# EAGLE design Quadcopter_Schematic_Final (EAGLE 7.2.0)
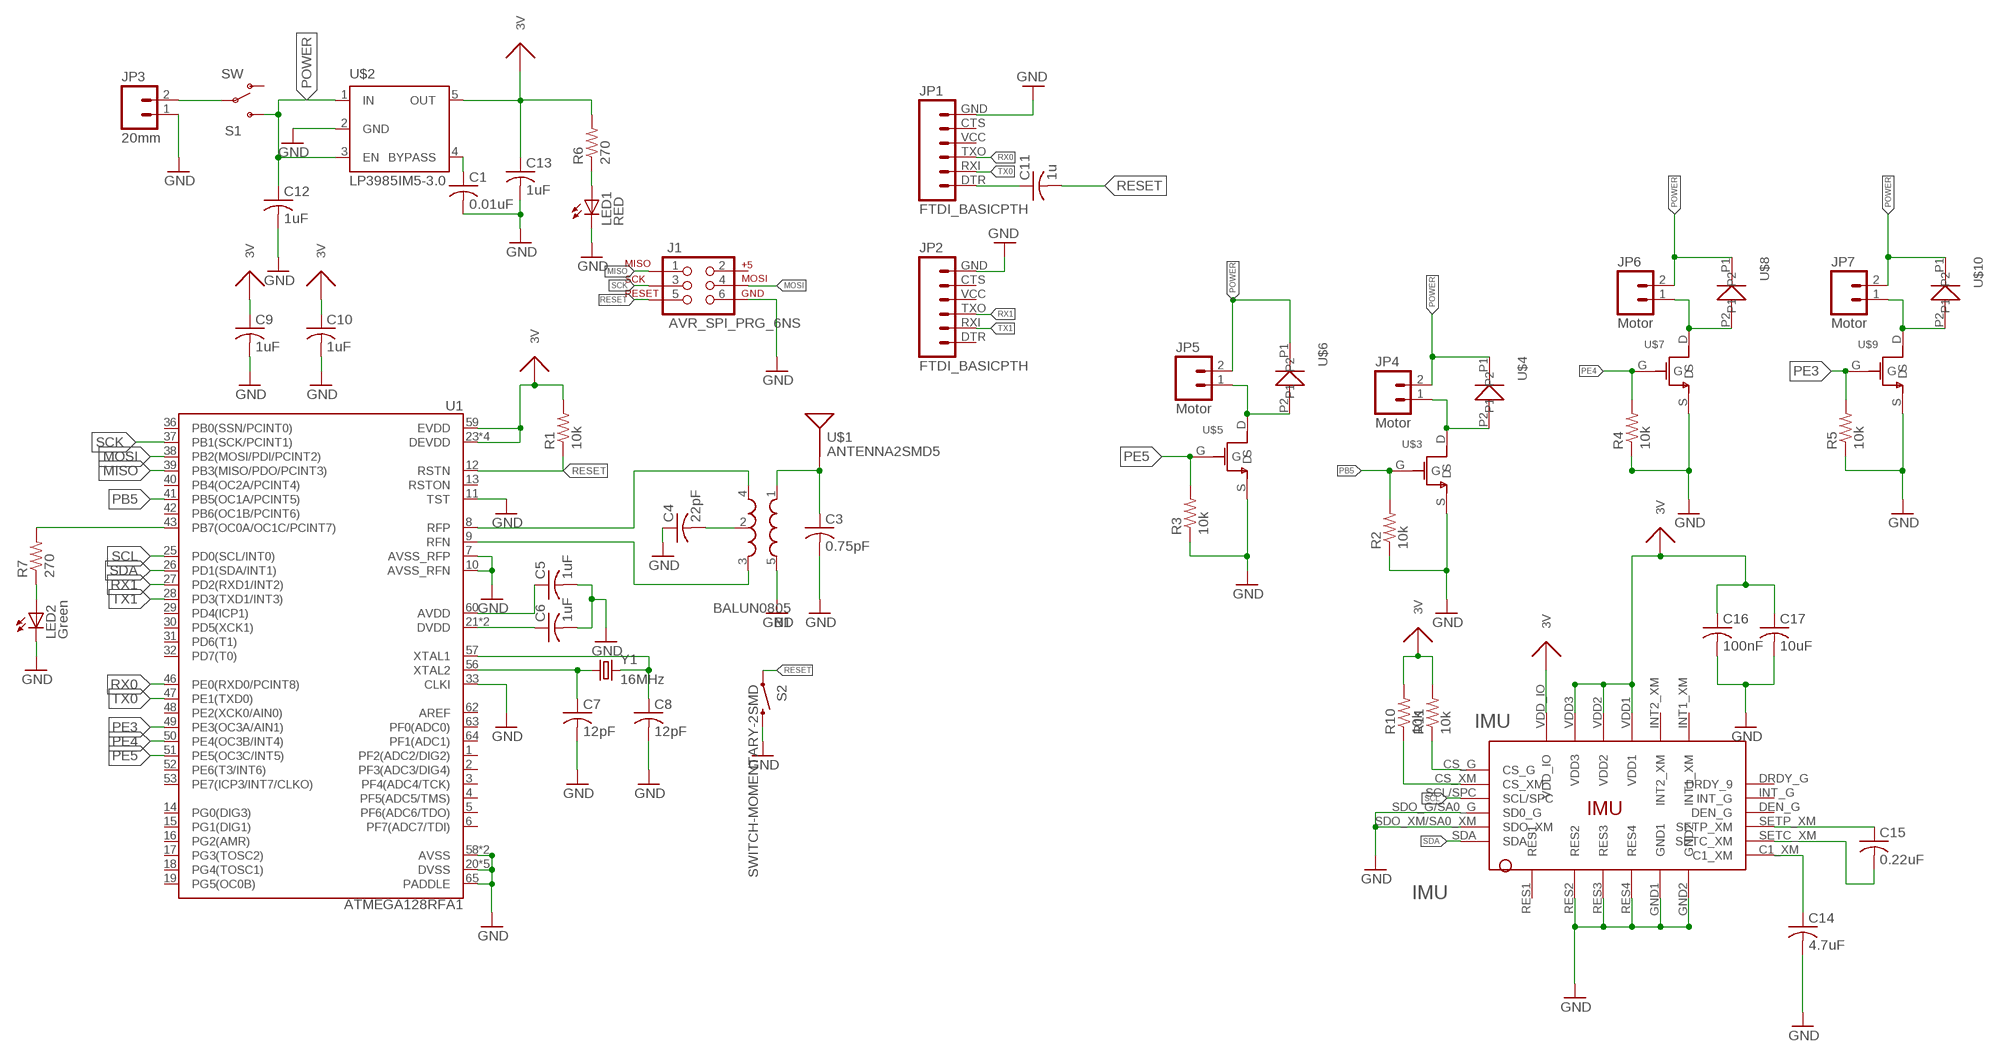
[diagram p0: schematic, sheet 1]

## Parts
B1  BALUN0805  [BALUN]
C1  0.01uF  C-USC0805  [C0805]
C3  0.75pF  C-USC0805  [C0805]
C4  22pF  C-USC0805  [C0805]
C5  1uF  C-USC0805  [C0805]
C6  1uF  C-USC0805  [C0805]
C7  12pF  C-USC0805  [C0805]
C8  12pF  C-USC0805  [C0805]
C9  1uF  C-USC0805  [C0805]
C10  1uF  C-USC0805  [C0805]
C11  1u  C-USC0805  [C0805]
C12  1uF  C-USC0805  [C0805]
C13  1uF  C-USC0805  [C0805]
C14  4.7uF  C-USC0805  [C0805]
C15  0.22uF  C-USC0805  [C0805]
C16  100nF  C-USC0805  [C0805]
C17  10uF  C-USC0805  [C0805]
IMU  IMU  LSM9DS0  [LSM9DS0]
J1  AVR_SPI_PRG_6NS  [2X3-NS]
JP1  FTDI_BASICPTH  [FTDI_BASIC]
JP2  FTDI_BASICPTH  [FTDI_BASIC]
JP3  20mm  M02PTH  [1X02]
JP4  Motor  M02PTH  [1X02]
JP5  Motor  M02PTH  [1X02]
JP6  Motor  M02PTH  [1X02]
JP7  Motor  M02PTH  [1X02]
LED1  RED  LEDCHIP-LED0805  [CHIP-LED0805]
LED2  Green  LEDCHIP-LED0805  [CHIP-LED0805]
R1  10k  R-US_R0805  [R0805]
R2  10k  R-US_R0805  [R0805]
R3  10k  R-US_R0805  [R0805]
R4  10k  R-US_R0805  [R0805]
R5  10k  R-US_R0805  [R0805]
R6  270  R-US_R0805  [R0805]
R7  270  R-US_R0805  [R0805]
R10  10k  R-US_R0805  [R0805]
R11  10k  R-US_R0805  [R0805]
S1  SW  SWITCH-SPDTPTH  [SWITCH-SPDT]
S2  SWITCH-MOMENTARY-2SMD  [TACTILE_SWITCH_SMD]
U1  ATMEGA128RFA1  [QFN-64]
U$1  ANTENNA2SMD5  [ANTENNA-CHIP5]
U$2  LP3985IM5-3.0  [SOT23-DBV]
U$3  NMOS  SI2302DS_MOSFET  [SI2302DS_MOSFET]
U$4  Diode  BAS16WS_DIODE  [BAS16WS_DIODE]
U$5  NMOS  SI2302DS_MOSFET  [SI2302DS_MOSFET]
U$6  Diode  BAS16WS_DIODE  [BAS16WS_DIODE]
U$7  NMOS  SI2302DS_MOSFET  [SI2302DS_MOSFET]
U$8  Diode  BAS16WS_DIODE  [BAS16WS_DIODE]
U$9  NMOS  SI2302DS_MOSFET  [SI2302DS_MOSFET]
U$10  Diode  BAS16WS_DIODE  [BAS16WS_DIODE]
Y1  16MHz  CRYSTAL5X3  [CRYSTAL-SMD-5X3]

## Nets
3V: C9.1 C10.1 C13.1 C16.1 C17.1 IMU.VDD1 IMU.VDD2 IMU.VDD3 IMU.VDD_IO R1.2 R6.2 R10.2 R11.2 U1.23(DEVDD) U1.34(DEVDD) U1.44(DEVDD) U1.54(DEVDD) U1.59(EVDD) U$2.5(OUT)
FTDI: C11.1 JP1.DTR
GND: B1.5(GND) C1.2 C3.2 C4.1 C5.2 C6.2 C7.2 C8.2 C9.2 C10.2 C12.2 C13.2 C14.2 C16.2 C17.2 IMU.GND1 IMU.GND2 IMU.RES2 IMU.RES3 IMU.RES4 IMU.SDO_G/SA0_G(SD0_G) IMU.SDO_XM/SA0_XM(SDO_XM) J1.6 JP1.GND JP2.GND JP3.1 LED1.C LED2.C R2.1 R3.1 R4.1 R5.1 S2.3 U1.7(AVSS_RFP) U1.10(AVSS_RFN) U1.11(TST) U1.20(DVSS) U1.24(DVSS) U1.33(CLKI) U1.35(DVSS) U1.45(DVSS) U1.55(DVSS) U1.58(AVSS) U1.61(AVSS) U1.65(PADDLE) U$2.2(GND) U$3.S U$5.S U$7.S U$9.S
MISO: J1.1 U1.39(PB3(MISO/PDO/PCINT3))
MOSI: J1.4 U1.38(PB2(MOSI/PDI/PCINT2))
N$1: B1.4(OUT1) U1.8(RFP)
N$2 [HIGHCURRENT]: JP5.1 U$5.D U$6.P2
N$3: JP3.2 S1.2(P)
N$4: C5.1 U1.60(AVDD)
N$5: C6.1 U1.21(DVDD) U1.22(DVDD)
N$6: B1.2(GND) C4.2
N$7: B1.3(OUT2) U1.9(RFN)
N$8: C8.1 U1.57(XTAL1) Y1.3
N$9 [RFSIG]: B1.1(IN) C3.1 U$1.FEED(SIGNAL)
N$10: LED1.A R6.1
N$11: LED2.A R7.1
N$12: C7.1 U1.56(XTAL2) Y1.1
N$14: C1.1 U$2.4(BYPASS)
N$15: IMU.CS_G R11.1
N$16: IMU.CS_XM R10.1
N$22 [HIGHCURRENT]: JP4.1 U$3.D U$4.P2
N$23: C14.1 IMU.C1_XM
N$24: C15.2 IMU.SETC_XM
N$25: C15.1 IMU.SETP_XM
N$33 [HIGHCURRENT]: JP6.1 U$7.D U$8.P2
N$38 [HIGHCURRENT]: JP7.1 U$9.D U$10.P2
PB5: R2.2 U1.41(PB5(OC1A/PCINT5)) U$3.G
PB7: R7.2 U1.43(PB7(OC0A/OC1C/PCINT7))
PE3: R5.2 U1.49(PE3(OC3A/AIN1)) U$9.G
PE4: R4.2 U1.50(PE4(OC3B/INT4)) U$7.G
PE5: R3.2 U1.51(PE5(OC3C/INT5)) U$5.G
POWER [HIGHCURRENT]: C12.1 JP4.2 JP5.2 JP6.2 JP7.2 S1.3(S) U$2.1(IN) U$2.3(EN) U$4.P1 U$6.P1 U$8.P1 U$10.P1
RESET: C11.2 J1.5 R1.1 S2.1 U1.12(RSTN)
RX0: JP1.TXO U1.46(PE0(RXD0/PCINT8))
RX1: JP2.TXO U1.27(PD2(RXD1/INT2))
SCK: J1.3 U1.37(PB1(SCK/PCINT1))
SCL: IMU.SCL/SPC U1.25(PD0(SCL/INT0))
SDA: IMU.SDA U1.26(PD1(SDA/INT1))
TX0: JP1.RXI U1.47(PE1(TXD0))
TX1: JP2.RXI U1.28(PD3(TXD1/INT3))
Unconnected: IMU.DEN_G IMU.DRDY_G(DRDY_9) IMU.INT1_XM IMU.INT2_XM IMU.INT_G IMU.RES1 J1.2 JP1.CTS JP1.VCC JP2.CTS JP2.DTR JP2.VCC S1.1(O) U1.1(PF2(ADC2/DIG2)) U1.2(PF3(ADC3/DIG4)) U1.3(PF4(ADC4/TCK)) U1.4(PF5(ADC5/TMS)) U1.5(PF6(ADC6/TDO)) U1.6(PF7(ADC7/TDI)) U1.13(RSTON) U1.14(PG0(DIG3)) U1.15(PG1(DIG1)) U1.16(PG2(AMR)) U1.17(PG3(TOSC2)) U1.18(PG4(TOSC1)) U1.19(PG5(OC0B)) U1.29(PD4(ICP1)) U1.30(PD5(XCK1)) U1.31(PD6(T1)) U1.32(PD7(T0)) U1.36(PB0(SSN/PCINT0)) U1.40(PB4(OC2A/PCINT4)) U1.42(PB6(OC1B/PCINT6)) U1.48(PE2(XCK0/AIN0)) U1.52(PE6(T3/INT6)) U1.53(PE7(ICP3/INT7/CLKO)) U1.62(AREF) U1.63(PF0(ADC0)) U1.64(PF1(ADC1))

## Library data of the parts
B1 = Lab5:BALUN: 0805 footprint balun- Ember 351/357
C1 C3-C17 = Lab5:C-US: CAPACITOR, American symbol
IMU = Andranik-Lab4:LSM9DS0; DIST: Digikey; DISTPN: LSM9DS0
J1 = Lab5:AVR_SPI_PRG_6: AVR ISP 6 Pin This is the reduced ISP connector for AVR programming. Common on Arduino. This footprint will take up less PCB space and can be used with a 10-pin to 6-pin adapter such as SKU: BOB-08508
JP1 JP2 = Lab5:FTDI_BASIC: FTDI Basic header with labels
JP3-JP7 = Lab5:M02: Header 2 Standard 2-pin 0.1" header. Use with straight break away headers (SKU : PRT-00116), right angle break away headers (PRT-00553), swiss pins (PRT-00743), machine pins (PRT-00117), and female headers (PRT-00115). Molex polarized connector foot print use with SKU : PRT-08233 with associated crimp pins and housings.
LED1 LED2 = Lab5:LED: LED OSRAM: - CHIPLED LG R971, LG N971, LY N971, LG Q971, LY Q971, LO R971, LY R971 LH N974, LH R974 LS Q976, LO Q976, LY Q976 LO Q996 - Hyper CHIPLED LW Q18S LB Q993, LB Q99A, LB R99A - SideLED LS A670, LO A670, LY A670, LG A670, LP A670 LB A673, LV A673, LT A673, LW A673 LH A674 LY A675 LS A676, LA A676, LO A676, LY A676, LW A676 LS A679, LY A679, LG A679 - Hyper Micro SIDELED® LS Y876, LA Y876, LO Y876, LY Y876 LT Y87S - SmartLED LW L88C, LW L88S LB L89C, LB L89S, LG L890 LS L89K, LO L89K, LY L89K LS L896, LA L896, LO L896, LY L896 - TOPLED LS T670, LO T670, LY T670, LG T670, LP T670 LSG T670, LSP T670, LSY T670, LOP T670, LYG T670 LG T671, LOG T671, LSG T671 LB T673, LV T673, LT T673, LW T673 LH T674 LS T676, LA T676, LO T676, LY T676, LB T676, LH T676, LSB T676, LW T676 LB T67C, LV T67C, LT T67C, LS T67K, LO T67K, LY T67K, LW E67C LS E67B, LA E67B, LO E67B, LY E67B, LB E67C, LV E67C, LT E67C LW T67C LS T679, LY T679, LG T679 LS T770, LO T770, LY T770, LG T770, LP T770 LB T773, LV T773, LT T773, LW T773 LH T774 LS E675, LA E675, LY E675, LS T675 LS T776, LA T776, LO T776, LY T776, LB T776 LHGB T686 LT T68C, LB T68C - Hyper Mini TOPLED® LB M676 - Mini TOPLED Santana® LG M470 LS M47K, LO M47K, LY M47K Source: http://www.osram.convergy.de LUXEON: - LUMILED® LXK2-PW12-R00, LXK2-PW12-S00, LXK2-PW14-U00, LXK2-PW14-V00 LXK2-PM12-R00, LXK2-PM12-S00, LXK2-PM14-U00 LXK2-PE12-Q00, LXK2-PE12-R00, LXK2-PE12-S00, LXK2-PE14-T00, LXK2-PE14-U00 LXK2-PB12-K00, LXK2-PB12-L00, LXK2-PB12-M00, LXK2-PB14-N00, LXK2-PB14-P00, LXK2-PB14-Q00 LXK2-PR12-L00, LXK2-PR12-M00, LXK2-PR14-Q00, LXK2-PR14-R00 LXK2-PD12-Q00, LXK2-PD12-R00, LXK2-PD12-S00 LXK2-PH12-R00, LXK2-PH12-S00 LXK2-PL12-P00, LXK2-PL12-Q00, LXK2-PL12-R00 Source: www.luxeon.com KINGBRIGHT: KA-3528ASYC Source: www.kingbright.com
R1-R7 R10 R11 = Lab5:R-US_: RESISTOR, American symbol
S1 = Lab5:SWITCH-SPDT: SPDT Switch Simple slide switch, Spark Fun Electronics SKU : COM-00102 DPDT SMT slide switch, AYZ0202, SWCH-08179; PROD_ID: SWCH-08261
S2 = Lab5:SWITCH-MOMENTARY-2: Various NO switches- pushbuttons, reed, etc
U1 = Lab5:ATMEGA128RFA1: ATmega128RFA1 8-bit AVR Microcontroller with Low Power 2.4GHz Transceiver for ZigBee and IEEE 802.15.4
U$1 = Lab5:ANTENNA2: Chip antenna Single endded antenna. Common with smaller chip antennas. CHIP4 package is the GPS Chip Antenna SKU: GPS-08418. CHIP5 package is 2.4GHz chip antenna SKU: WRL-00144.
U$2 = Lab5:LP3985IM5-3.0
U$3 U$5 U$7 U$9 = Andranik-Lab4:SI2302DS_MOSFET; DIST: Digikey; DISTPN: Si2302CDS
U$4 U$6 U$8 U$10 = Andranik-Lab4:BAS16WS_DIODE; DIST: VISHAY; DISTPT: BAS16WS
Y1 = Lab5:CRYSTAL: Various standard crystals. Proven footprints. Spark Fun Electronics SKU : COM-00534

## Net classes
0 default: clearance 0.205 mm
1 RFSIG: width 0.457 mm
2 HIGHCURRENT: width 0.457 mm

## Board
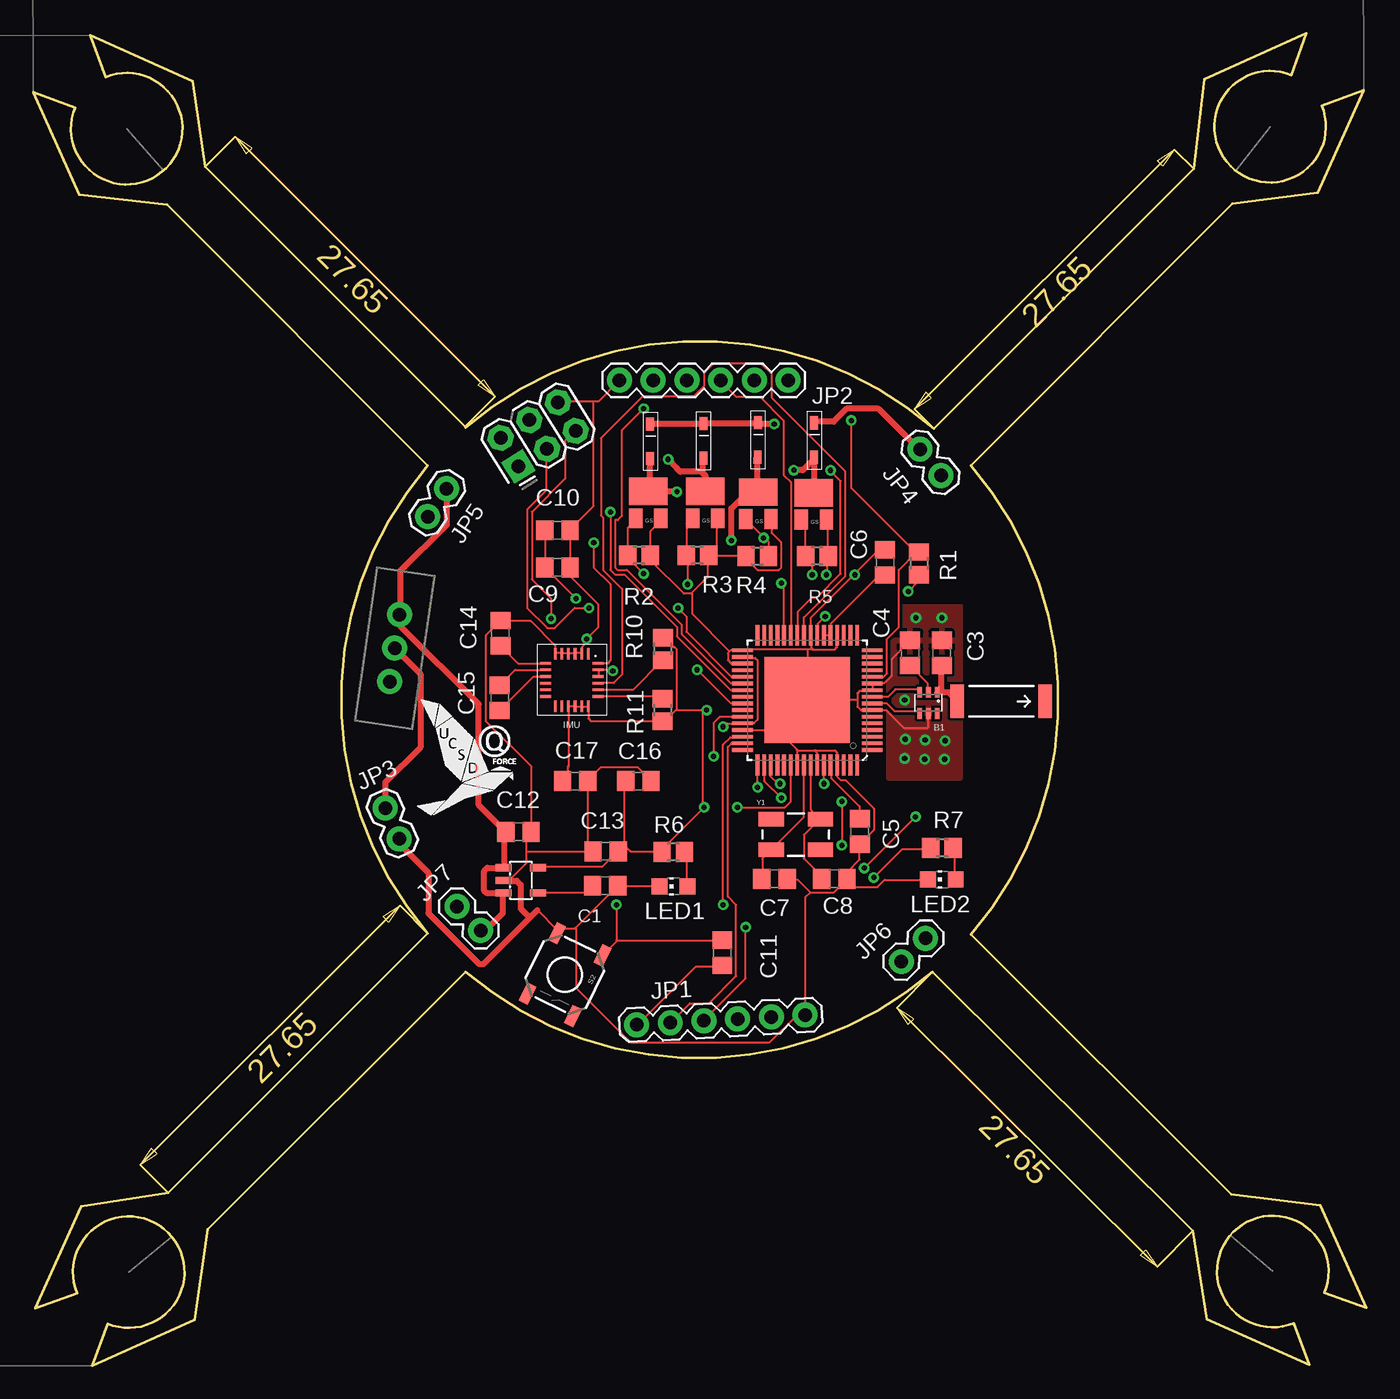
[diagram p1: board, top side]
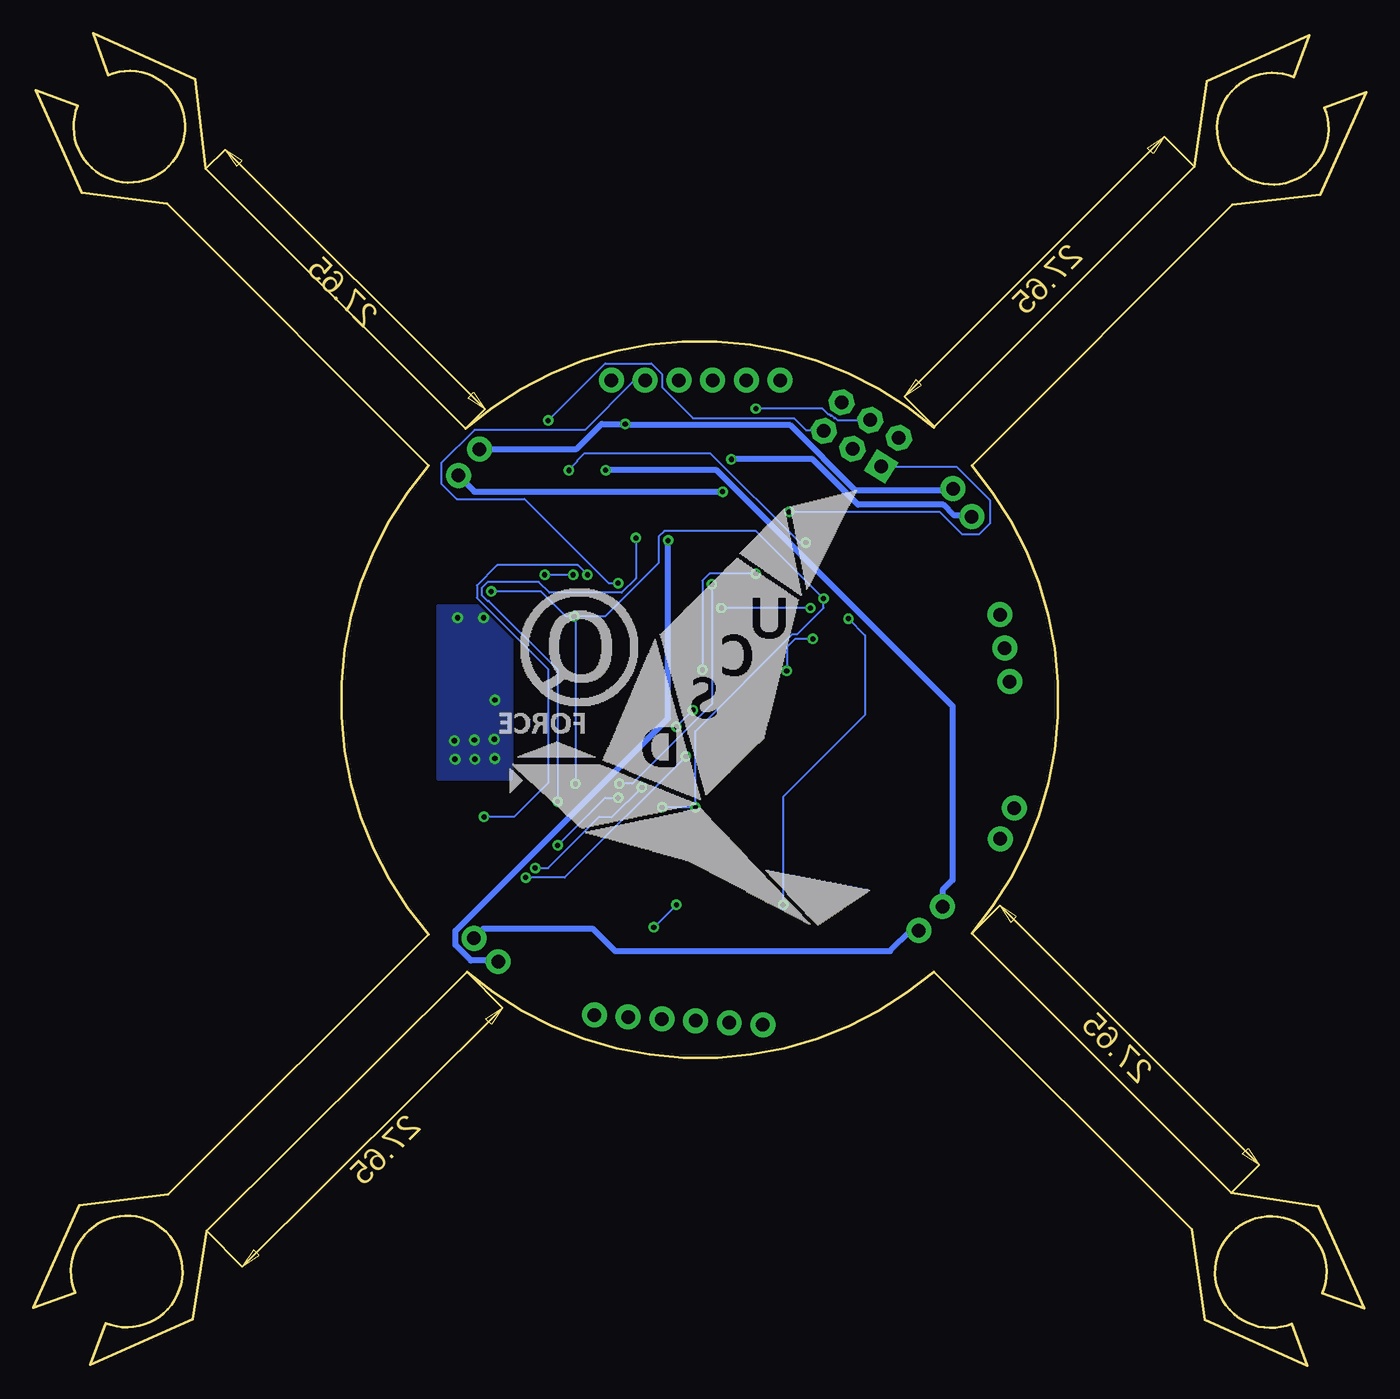
[diagram p2: board, bottom side, seen from below]

Size 100.35 x 100.3 mm. Coordinates in mm from the lower left corner, seen from the top.
Outline: 32.5,70.7 12.95,90.25 12,96.7 4.3,100.15 5.45,97 arc-314 3.15,94.7 0,95.85 3.45,88.15 10.1,87.4 29.7,67.75 arc81 29.7,32.55 10.15,13 3.6,12 0.15,4.3 3.3,5.45 arc-314 5.6,3.15 4.45,0 12.15,3.45 13.15,10.25 32.55,29.65 arc81 67.7,29.65 87.3,10.15 88.35,3.5 96.05,0.05 94.9,3.2 arc-314 97.2,5.5 100.35,4.35 96.9,12.05 90.2,12.9 70.6,32.45 arc82 70.6,67.75 90.25,87.45 96.7,88.3 100.15,96 97,94.85 arc-314 94.7,97.15 95.85,100.3 88.15,96.85 87.35,90.1 67.8,70.55 arc82 32.55,70.6
Copper layers (1*16): Top 0.035559375mm / dielectric 1.501140625mm / Bottom 0.035559375mm
Design rules "4pcb-33board": minimum track width 6mil, minimum drill 15mil, track to track 6mil, track to pad 6mil, pad to pad 6mil, via to via 6mil, smd to smd 6mil, copper to edge 10mil, drill to drill 10mil, minimum pad ring 10mil, minimum via ring 8mil, stop-mask expansion 4mil, vias tented up to drill 0mil, thermal gap 10mil
tRestrict: area 70.3,42 to 75.4,62.5; area 38,53.2 to 39,54.1; area 42,53.2 to 43.1,54.2; area 42.1,49.1 to 43,49.9; area 38,49.2 to 38.9,50; area 39.2,50.4 to 41.8,52.8
bRestrict: area 70.2,41.9 to 75.4,62.5; area 39.2,50.4 to 41.8,52.9; area 38,49.1 to 38.9,50; area 42.1,49.1 to 43,50; area 38,53.2 to 39,54.1; area 42.1,53.1 to 43.1,54.2

### Footprints (pad centres in the part's own frame; a part is rotated, then mirrored left to right if it is on the bottom)
BALUN = smd 0.35 x 0.8: 1 -0.65,-0.8; 2 0,-0.8; 3 0.65,-0.8; 4 0.65,0.8; 5 0,0.8; 6 -0.65,0.8
C0805 = smd 1.3 x 1.5: 1 -0.95,0; 2 0.95,0
LSM9DS0 = smd 0.85 x 0.2: C1_XM 1.975,-1.25; CS_G -1.975,1.25; CS_XM -1.975,0.75; DEN_G 1.975,0.25; DRDY_G 1.975,1.25; INT_G 1.975,0.75; SCL/SPC -1.975,0.25; SDA -1.975,-1.25; SDO_G/SA0_G -1.975,-0.25; SDO_XM/SA0_XM -1.975,-0.75; SETC_XM 1.975,-0.75; SETP_XM 1.975,-0.25 | smd 0.2 x 0.85: GND1 0.75,-1.975; GND2 1.25,-1.975; INT1_XM 1.25,1.975; INT2_XM 0.75,1.975; RES1 -1.25,-1.975; RES2 -0.75,-1.975; RES3 -0.25,-1.975; RES4 0.25,-1.975; VDD1 0.25,1.975; VDD2 -0.25,1.975; VDD3 -0.75,1.975; VDD_IO -1.25,1.975
2X3-NS = drill 1.016 pad 1.88 square: 1 -2.54,-1.27 | drill 1.016 pad 1.88 octagon: 2 -2.54,1.27; 3 0,-1.27; 4 0,1.27; 5 2.54,-1.27; 6 2.54,1.27
FTDI_BASIC = drill 1.016 pad 1.88: CTS 10.16,0; DTR 0,0; GND 12.7,0; RXI 2.54,0; TXO 5.08,0; VCC 7.62,0
1X02 = drill 1.016 pad 1.88: 1 0,0; 2 2.54,0
CHIP-LED0805 = smd 1.2 x 1.2: A 0,-1.05; C 0,1.05
R0805 = smd 1.3 x 1.5: 1 -0.85,0; 2 0.85,0
SWITCH-SPDT = drill 1.016 pad 1.88: 1 0,2.54; 2 0,0; 3 0,-2.54
TACTILE_SWITCH_SMD = smd 1.524 x 0.762: 1 -2.54,1.905; 2 2.54,1.905; 3 -2.54,-1.905; 4 2.54,-1.905
QFN-64 = smd 1.562 x 0.28: 1 -4.881,3.75; 2 -4.881,3.25; 3 -4.881,2.75; 4 -4.881,2.25; 5 -4.881,1.75; 6 -4.881,1.25; 7 -4.881,0.75; 8 -4.881,0.25; 9 -4.881,-0.25; 10 -4.881,-0.75; 11 -4.881,-1.25; 12 -4.881,-1.75; 13 -4.881,-2.25; 14 -4.881,-2.75; 15 -4.881,-3.25; 16 -4.881,-3.75; 33 4.881,-3.75; 34 4.881,-3.25; 35 4.881,-2.75; 36 4.881,-2.25; 37 4.881,-1.75; 38 4.881,-1.25; 39 4.881,-0.75; 40 4.881,-0.25; 41 4.881,0.25; 42 4.881,0.75; 43 4.881,1.25; 44 4.881,1.75; 45 4.881,2.25; 46 4.881,2.75; 47 4.881,3.25; 48 4.881,3.75 | smd 0.28 x 1.562: 17 -3.75,-4.881; 18 -3.25,-4.881; 19 -2.75,-4.881; 20 -2.25,-4.881; 21 -1.75,-4.881; 22 -1.25,-4.881; 23 -0.75,-4.881; 24 -0.25,-4.881; 25 0.25,-4.881; 26 0.75,-4.881; 27 1.25,-4.881; 28 1.75,-4.881; 29 2.25,-4.881; 30 2.75,-4.881; 31 3.25,-4.881; 32 3.75,-4.881; 49 3.75,4.881; 50 3.25,4.881; 51 2.75,4.881; 52 2.25,4.881; 53 1.75,4.881; 54 1.25,4.881; 55 0.75,4.881; 56 0.25,4.881; 57 -0.25,4.881; 58 -0.75,4.881; 59 -1.25,4.881; 60 -1.75,4.881; 61 -2.25,4.881; 62 -2.75,4.881; 63 -3.25,4.881; 64 -3.75,4.881 | smd 6.452 x 6.452: 65 0,0
ANTENNA-CHIP5 = smd 1.016 x 2.54: FEED -3.302,0; NC 3.302,0
SOT23-DBV = smd 0.55 x 1.2: 1 -0.95,-1.3; 2 0,-1.3; 3 0.95,-1.3; 4 0.95,1.3; 5 -0.95,1.3
SI2302DS_MOSFET = smd 2.9 x 2.05: D 0,1.85 | smd 1 x 1.5: G -0.95,-0.175; S 0.95,-0.175
BAS16WS_DIODE = smd 1 x 0.6: P1 -1.3,0; P2 1.3,0
CRYSTAL-SMD-5X3 = smd 1.9 x 1.1: 1 -1.85,-1.15; 2 1.85,-1.15; 3 1.85,1.15; 4 -1.85,1.15

### Placement (x,y rotation side)
B1  67.39,49.89 180 top
C1  43.05,36.13 0 top
C3  68.4,53.65 90 top
C4  66,53.65 270 top
C5  62.23,40.21 270 top
C6  64.12,60.46 90 top
C7  55.8,36.65 0 top
C8  60.3,36.65 0 top
C9  39.46,60.08 0 top
C10  39.46,62.88 0 top
C11  51.87,31.07 90 top
C12  36.53,40.18 0 top
C13  43.1,38.72 180 top
C14  35.17,55.14 90 top
C15  35.12,50.26 90 top
C16  45.55,44 0 top
C17  40.8,44 0 top
IMU  40.54,51.62 180 top
J1  38.01,70.1 31.8 top
JP1  45.42,25.66 3.3 top
JP2  56.83,74.17 180 top
JP3  27.55,39.66 114.3 top
JP4  68.34,67 128.5 top
JP5  29.7,63.91 56.2 top
JP6  65.35,30.41 43.9 top
JP7  31.9,34.56 314.7 top
LED1  48.19,36.08 90 top
LED2  68.39,36.59 90 top
R1  66.68,60.39 270 top
R2  45.6,61 180 top
R3  50,61 180 top
R4  54.5,60.95 0 top
R5  59,60.95 180 top
R6  48.18,38.67 180 top
R7  68.41,38.97 180 top
R10  47.4,53.95 90 top
R11  47.38,49.35 270 top
S1  27.21,54.01 171.7 top
S2  40.03,29.44 243.9 top
U1  58.27,50.1 180 top
U$1  72.87,50.01 0 top
U$2  36.71,36.53 270 top
U$3  46.3,63.96 0 top
U$4  46.44,69.58 270 top
U$5  50.59,63.96 0 top
U$6  50.44,69.61 270 top
U$7  54.58,63.91 0 top
U$8  54.54,69.69 269.9 top
U$9  58.77,63.86 0 top
U$10  58.79,69.67 270 top
U$11  [LOGOSBOTTOM]  31,30.8 0 top
U$12  [LOGOS]  27.2,40.8 0 top
Y1  57.41,39.98 0 top

### Tracks (layer width: path | path; a pad name or v marks a point on that pad's centre or on a via)
3V  (via drill 0.38)
  Top 0.152: U1.44 53.46,48.36 54.26,48.36 54.53,48.63 54.53,53.1 54.35,53.28 53.46,53.28 U1.34 | C17.1 39.88,44.07 40.23,44.43 40.23,45.1 40.3,45.1 40.3,49.61 40.23,49.61 IMU.VDD1 40.32,49.61 40.77,49.61 IMU.VDD2 40.86,49.61 41.21,49.61 IMU.VDD3 41.3,49.61 41.75,49.61 IMU.VDD_IO 41.84,49.61 41.8,49.57 41.8,48.7 41.96,48.54 47.29,48.54 R11.2 47.38,48.54 47.56,48.54 48.41,49.39 | 48.41,49.39 48.45,49.43 48.45,53.9 48.27,54.08 48.18,54.08 47.47,54.8 R10.2 | v51.94,48.09 52.19,48.35 U1.44 | 50.42,49.35 48.45,49.35 48.41,49.39 | 53.37,48.27 U1.44 | v65.88,58.28 66.68,59.09 R1.2 | v59.62,56.41 59.09,55.87 59.09,55.06 U1.23 | v59.53,43.81 59.53,45.15 U1.59 | C10.1 38.53,62.84 38.53,60.16 C9.1 38.53,60.07 v40.86,57.74 | U$2.5 38.09,37.55 42.82,37.55 43.98,38.71 C13.1 | C16.1 44.52,43.98 44.52,39.25 44.07,38.8 C13.1 | 47.2,38.71 44.97,38.71 44.52,39.16 C13.1 | 47.2,38.71 47.29,38.71 R6.2 47.2,38.71 | v53.01,42.02 56.58,42.02 57.03,42.47 57.03,45.15 U1.54 | 47.2,38.71 v50.51,42.02 50.42,42.02 50.42,49.35 | 50.42,49.35 v50.69,49.35
  Bottom 0.152: v50.69,49.35 v51.94,48.09 | v65.88,58.28 62.12,58.28 60.25,56.41 v59.62,56.41 | v59.53,43.81 59.53,56.31 v59.62,56.41 | v53.01,42.02 v50.51,42.02 50.51,47.74 43.18,55.06 42.82,55.06 40.86,57.03 v40.86,57.74 45.95,62.84 52.83,62.84 53.28,62.39 53.28,60.42 57.3,56.41 v59.62,56.41
FTDI
  Top 0.152: C11.1 51.85,30.05 49.88,30.05 45.5,25.67 JP1.DTR
GND  (via drill 0.38, 0.4)
  Top 0.152: LED2.C 67.31,36.57 64.09,36.57 63.55,36.03 61.85,36.03 61.32,36.57 C8.2 | 58.5,35.63 58.55,35.59 60.25,35.59 61.23,36.57 C8.2 | 58.5,35.63 57.57,36.57 56.76,36.57 C7.2 | C8.2 61.32,36.66 61.32,37.19 62.21,38.09 62.21,39.25 C5.2 62.3,39.34 63.28,40.32 63.28,41.93 61.14,44.07 60.78,44.07 60.52,44.34 60.52,45.15 U1.61 60.52,45.24 60.52,46.13 60.34,46.31 58.91,46.31 58.86,46.26 | 58.5,35.63 58.1,35.23 58.1,26.47 JP1.GND 58.01,26.38 57.48,26.38 55.42,24.33 44.97,24.33 40.86,28.44 40.86,32.91 40.81,32.95 | 62.03,50.15 62.03,50.6 62.21,50.77 63.11,50.77 U1.10 63.2,50.87 63.2,51.31 U1.11 63.2,51.4 64.09,51.4 64.62,51.94 64.62,53.19 65.79,54.35 65.97,54.35 C4.1 | 62.03,50.15 62.03,49.61 62.3,49.35 63.11,49.35 U1.7 64.2,49.35 65.55,48 67.35,48 67.35,49.05 B1.5 | U1.45 53.46,47.83 55.96,47.83 58.19,50.06 U1.65 | 57.48,46.31 57.48,46.4 56.05,47.83 U1.65 | 57.48,46.31 57.48,45.24 U1.55 | 58.86,46.26 58.82,46.31 57.48,46.31 | 58.86,46.26 59,46.13 59,45.24 U1.58 | 58.28,50.15 62.03,50.15 | 46.49,61.05 R2.1 | U$3.S 47.38,63.73 46.45,62.8 R2.1 | 51.49,60.96 50.87,60.96 R3.1 | 51.49,60.96 53.63,60.96 R4.1 53.72,60.87 53.72,60.69 54.53,59.89 56.14,59.89 56.31,60.07 56.31,61.94 55.6,62.66 55.6,63.73 U$7.S | 51.49,60.96 51.49,63.73 U$5.S | 51.49,60.96 R3.1 | 49.57,58.15 50.77,59.35 50.77,60.96 R3.1 | 49.57,58.15 49.52,58.1 48.99,58.1 46.49,60.6 46.49,60.96 R2.1 | U$9.S 59.8,63.64 59.8,60.96 R5.1 59.8,60.87 59.8,59.62 v59.71,59.53 | 52.43,53.77 52.47,53.81 53.37,53.81 U1.33 53.46,53.9 58.28,53.9 | 52.43,53.77 52.29,53.63 52.29,53.1 52.54,52.85 U1.35 53.37,52.92 | 61.81,59.58 58.55,56.31 58.55,55.06 U1.24 58.55,54.98 58.55,54.08 58.68,53.95
  Top 0.152: 61.81,59.58 63.64,61.41 64.09,61.41 C6.2 | 58.68,53.95 58.73,53.9 60.34,53.9 60.52,54.08 U1.20 | 58.28,53.9 58.64,53.9 58.68,53.95 | v61.85,59.53 61.81,59.58 | 52.43,53.77 49.61,56.58 49.61,58.1 49.57,58.15 | 58.28,53.9 58.28,50.15 | 58.28,50.15 U1.65 | LED1.C 47.11,36.12 44.07,36.12 C1.2 43.98,36.12 40.81,32.95 | 37.1,38.71 37.1,39.78 37.46,40.14 C12.2 37.46,40.23 37.46,45.15 34.07,48.54 34.07,54.98 35.14,56.05 C14.2 35.23,56.05 37.46,56.05 39.29,54.22 IMU.GND2 | 37.1,38.71 37.1,37.82 35.85,36.57 35.5,36.57 U$2.2 35.94,36.57 | 37.1,38.71 41.75,38.71 | 41.75,38.71 42.11,38.71 C13.2 41.75,38.71 | 41.75,38.71 41.75,43.98 C17.2 41.75,44.07 42.73,45.06 45.5,45.06 46.49,44.07 C16.2 | 37.95,34.29 39.43,32.82 39.43,32.64 S2.3 39.43,32.91 40.77,32.91 40.81,32.95 | 42.2,72.58 42.55,72.58 44.07,74.1 JP2.GND | 42.2,72.58 39.52,72.58 J1.6 | IMU.SDO_G/SA0_G 42.55,51.94 42.55,52.29 IMU.SDO_XM/SA0_XM 43.55,52.37 v43.63,52.29 | IMU.GND2 39.34,53.63 39.78,53.63 IMU.GND1 39.88,53.63 40.23,53.63 IMU.RES4 40.32,53.63 40.77,53.63 IMU.RES3 40.86,53.63 41.21,53.63 IMU.RES2 41.3,53.63 41.3,54.08 41.66,54.44 v41.66,54.71 42.55,55.6 42.55,57.3 40.41,59.44 40.41,60.07 C9.2 40.41,60.16 40.41,62.84 C10.2 40.41,62.93 42.2,64.71 42.2,72.58 | 39.25,53.63 IMU.GND2
  Top 0.406: 27.55,39.3 JP3.1
  Top 0.457: 37.95,34.29 37.41,33.74 | 37.41,33.74 33.89,30.22 33.58,30.22 29.75,34.05 29.75,37.1 27.55,39.3 | 35.94,36.57 36.01,36.5 36.4,36.5 36.7,36.2 36.7,34.4 37.36,33.74 37.41,33.74
  Bottom 0.152: v61.85,59.53 v59.71,59.53 | v43.63,52.29 43.63,54.08 43,54.71 v41.66,54.71
  other vias: 65.6,50.1 67.1,45.65 67.15,47.1 68.65,47.05 68.6,45.65 65.6,45.7 65.65,47.15 68.4,56.3 66.45,56.3
  pour Bottom: 69.8,57.15 69.8,44.25 64.4,44.2 64.4,57.1
  pour Top: 69.8,57.15 69.8,44.25 64.4,44.2 64.4,57.1
MISO  (via drill 0.38)
  Top 0.152: v43.45,64.27 43.45,59.89 43.81,59.53 44.52,59.53 48.45,55.6 48.45,54.89 52.47,50.87 53.37,50.87 U1.39
  Bottom 0.152: v43.45,64.27 32.1,64.27 30.4,62.57 29.15,62.57 28.35,63.37 28.35,65.16 30.85,67.66 36.48,67.66 J1.1
MOSI  (via drill 0.38)
  Top 0.152: v45.95,72.04 44.3,70.39 44.3,63.95 43.99,63.64 43.81,63.64 43.81,60.07 43.98,59.89 44.7,59.89 48.81,55.78 48.81,55.06 52.47,51.4 53.37,51.4 U1.38
  Bottom 0.152: v45.95,72.04 40.95,72.04 40.5,71.59 40.41,71.59 40.32,71.5 40.23,71.5 40.05,71.33 39.96,71.33 39.78,71.15 37.37,71.15 J1.4
N$1
  Top 0.152: B1.4 66.68,49.17 66.6,49.25 64.85,49.25 64.25,49.85 U1.8 63.2,49.79
N$2  (via drill 0.38)
  Top 0.457: U$6.P2 50.4,68.27 50.4,67.2 | 50.42,65.88 U$5.D 50.59,67.01 50.4,67.2 | 50.4,67.2 50.3,67.3 48.7,67.3 48.43,67.57 v47.79,68.22
  Bottom 0.457: JP5.1 29.78,64 31.03,64 31.83,64.8 38.27,64.8 41.69,68.22 v47.79,68.22
N$3
  Top 0.457: S1.2 29.15,52.07 29.15,46.55 26.5,43.91 JP3.2
N$4
  Top 0.152: C5.1 62.21,41.21 62.21,42.11 60.07,44.25 60.07,45.15 U1.60
N$5
  Top 0.152: C6.1 64.09,59.44 63.64,59.44 60.07,55.87 60.07,55.06 U1.21 59.98,54.98 59.53,54.98 U1.22
N$6
  Top 0.152: B1.2 67.31,50.77 67.31,51.4 66.05,52.65 C4.2
N$7
  Top 0.152: B1.3 66.68,50.69 66.65,50.72 66.65,50.9 64.9,50.9 64.35,50.35 U1.9 63.2,50.42
N$8
  Top 0.152: C8.1 59.26,36.66 59.26,36.93 58.01,38.18 58.01,39.96 59.17,41.13 Y1.3 59.17,41.21 58.55,41.84 58.55,45.15 U1.57
N$9
  Top 0.457: 68.38,50.69 68.91,50.69 69.54,50.06 U$1.FEED | 68.38,50.69 68.11,50.69 B1.1 | 68.38,50.69 68.38,52.65 C3.1
N$10
  Top 0.152: LED1.A 49.17,36.12 49.17,38.53 49.08,38.62 R6.1
N$11
  Top 0.152: LED2.A 69.36,36.66 69.36,38.8 69.27,38.89 R7.1
N$12
  Top 0.152: C7.1 54.89,36.66 54.89,38.18 55.51,38.8 Y1.1 55.6,38.89 58.01,41.3 58.01,45.15 U1.56
N$14
  Top 0.152: U$2.4 38.09,35.59 41.48,35.59 42.02,36.12 C1.1
N$15
  Top 0.152: R11.1 47.29,50.24 47.16,50.37 IMU.CS_G
N$16
  Top 0.152: R10.1 47.38,53.1 45.15,50.87 IMU.CS_XM
N$22  (via drill 0.38)
  Top 0.457: U$4.P2 46.49,68.2 46.4,68.11 46.4,66.55 46.3,66.45 U$3.D | 46.49,65.88 U$3.D | v48.45,65.79 46.66,65.79 U$3.D
  Bottom 0.457: v48.45,65.79 67.13,65.79 68.29,66.95 JP4.1
N$23
  Top 0.152: C14.1 36.49,52.87 IMU.C1_XM
N$24
  Top 0.152: C15.2 35.14,51.22 36.29,52.37 IMU.SETC_XM
N$25
  Top 0.152: 38.53,51.85 IMU.SETP_XM 37.66,51.87 35.14,49.35 C15.1
N$33  (via drill 0.38)
  Top 0.457: U$8.P2 54.53,68.38 54.53,65.79 U$7.D 54.35,65.7 53.72,65.7 52.56,64.53 v52.56,62.12
  Bottom 0.457: v52.56,62.12 52.56,48.72 68.56,32.73 68.56,31.65 67.39,30.49 65.43,30.49 JP6.1
N$38  (via drill 0.38)
  Top 0.457: 58.82,68.29 58.82,65.79 U$9.D | 58.82,68.29 U$10.P2 | 58.82,68.29 57.93,67.41 v57.26,67.41
  Bottom 0.457: JP7.1 31.9,35.8 31.15,36.55 31.15,49.64 48.91,67.41 v57.26,67.41
PB5  (via drill 0.38)
  Top 0.152: 44.79,61.05 R2.2 | U$3.G 45.41,63.73 44.75,63.07 R2.2 | v49.97,52.38 52.47,49.88 53.37,49.88 U1.41 | v45.95,59.62 44.79,60.78 44.79,60.96 R2.2
  Bottom 0.152: v49.97,52.38 49.97,59.09 49.43,59.62 v45.95,59.62
PB7  (via drill 0.38)
  Top 0.152: v63.28,36.75 65.43,38.89 67.48,38.89 R7.2 | v51.22,45.86 51.22,48.36 51.67,48.81 53.37,48.81 U1.43
  Bottom 0.152: v63.28,36.75 60.34,36.75 v51.22,45.86
PE3  (via drill 0.38)
  Top 0.152: U$9.G 57.83,63.64 58.1,63.37 58.1,60.96 R5.2 58.19,60.87 58.64,60.42 v58.64,59.53 | v54.53,43.54 54.53,45.15 U1.49 | v66.41,41.3 v62.57,37.46
  Bottom 0.152: v54.53,43.54 56.76,41.3 57.74,41.3 61.59,37.46 v62.57,37.46 | v58.64,59.53 59.35,60.25 65.43,60.25 66.95,58.72 66.95,57.8 61.6,52.45 61.6,43.85 64.15,41.3 v66.41,41.3
PE4  (via drill 0.38)
  Top 0.152: 55.02,62.35 U$7.G | 55.02,62.35 55.33,62.03 55.33,60.96 R4.2 | v56.31,42.73 55.06,43.98 55.06,45.15 U1.50 | v60.87,42.47 v60.87,39.16 | v54.98,62.3 55.02,62.35
  Bottom 0.152: v56.31,42.73 57.3,42.73 v60.87,39.16 | v60.87,42.47 60.87,52.38 66.05,57.57 66.14,57.57 66.59,58.01 66.59,58.55 66.14,59 62.3,59 61.5,58.19 56.05,58.19 54.98,59.26 v54.98,62.3
PE5  (via drill 0.38)
  Top 0.152: U$5.G 49.52,63.73 49.17,63.37 49.17,61.05 R3.2 49.17,60.96 49.26,60.87 v49.26,58.82 | v56.23,43.81 56.05,43.81 55.51,44.34 55.51,45.15 U1.51
  Bottom 0.152: v56.23,43.81 55.24,43.81 49.26,49.79 v49.26,58.82
POWER  (via drill 0.38)
  Top 0.457: U$4.P1 46.49,70.88 50.42,70.88 U$6.P1 50.6,70.97 54.53,70.97 U$8.P1 54.71,70.88 v55.78,70.88 | U$10.P1 58.82,71.06 60.25,71.06 61.23,72.04 63.64,72.04 66.68,69 JP4.2 | JP5.2 31.12,65.97 31.12,63.28 27.63,59.8 27.63,56.58 S1.3 27.63,56.31 27.63,55.69 33.53,49.79 33.53,42.2 35.41,40.32 C12.1 35.5,40.14 35.5,37.64 U$2.1 34.18,37.48 33.95,37.25 33.95,35.75 34.15,35.55 35.38,35.55 U$2.3 35.35,35.52 35.35,34.05 34.05,32.75 JP7.2
  Bottom 0.457: JP4.2 66.68,69 59.44,69 57.57,70.88 v55.78,70.88 55.6,70.79 43.36,70.79 38.45,65.88 31.21,65.88 31.12,65.97 JP5.2 | JP6.2 66.45,32.9 58.25,32.9 56.55,31.2 35.85,31.2 34.3,32.75 JP7.2
RESET  (via drill 0.38)
  Top 0.152: 43.94,31.97 42.91,30.94 S2.1 | 43.94,31.97 43.98,32.01 51.85,32.01 C11.2 | U1.12 63.2,51.85 64,51.85 64.27,52.12 64.27,54.71 65.16,55.6 65.16,59.89 66.5,61.23 R1.1 66.41,61.23 61.59,66.05 v61.59,71.15 | v43.89,34.69 43.89,32.01 43.94,31.97 | v38.98,56.23 38.98,57.74 37.55,59.17 37.55,64.27 40.05,66.77 40.05,69.63 40.77,70.34 J1.5
  Bottom 0.152: v61.59,71.15 57.3,75.44 53.81,75.44 53.01,74.63 53.01,73.65 50.69,71.33 43.09,71.33 42.2,70.43 40.86,70.43 J1.5 | v43.89,34.69 43.89,42.82 37.73,48.99 37.73,54.98 v38.98,56.23
RX0  (via drill 0.38)
  Top 0.152: v51.94,34.69 51.94,46.75 52.47,47.29 53.37,47.29 U1.46 | v53.63,32.99 53.63,29.15 50.51,26.02 JP1.TXO
  Bottom 0.152: v53.63,32.99 v51.94,34.69
RX1
  Top 0.152: U1.27 57.03,55.06 57.03,66.5 56.49,67.04 56.49,71.15 54.71,72.93 52.92,72.93 51.76,74.1 JP2.TXO
SCK  (via drill 0.38)
  Top 0.152: v48.54,57.03 49.17,56.41 49.17,55.24 52.56,51.85 53.37,51.85 U1.37 | v41.84,57.03 40.77,57.03 39.25,55.51 38.71,55.51 37.19,57.03 37.19,64.45 38.62,65.88 38.62,69 J1.3
  Bottom 0.152: v41.84,57.03 v48.54,57.03
SCL
  Top 0.152: 42.55,51.4 IMU.SCL/SPC 43.69,51.37 44.34,52.03 44.34,58.46 42.91,59.89 42.91,63.82 42.73,64 42.73,69.81 45.86,72.93 49.7,72.93 50.51,73.74 50.51,74.72 51.22,75.44 54.8,75.44 55.6,74.63 55.6,72.84 61.14,67.31 61.14,59.44 58.01,56.31 58.01,55.06 U1.25
SDA  (via drill 0.38)
  Top 0.152: v42.2,61.94 42.2,60.07 43.45,58.82 43.45,53.1 43.22,52.87 IMU.SDA 42.55,52.92 | U1.26 57.57,55.06 57.57,56.76 58.64,57.83 59,57.83 60.78,59.62 60.78,66.59 60.03,67.34 v60.03,67.39
  Bottom 0.152: v42.2,61.94 42.64,61.94 49.35,68.65 58.9,68.65 59.4,68.15 59.4,68.07 60.03,67.44 v60.03,67.39
TX0
  Top 0.152: U1.47 53.37,46.84 52.56,46.84 52.29,46.58 52.29,35.32 52.92,34.69 52.92,29.33 50.87,27.28 49.43,27.28 48.01,25.85 JP1.RXI
TX1  (via drill 0.38)
  Top 0.152: v56.31,58.91 56.49,58.73 56.49,55.06 U1.28
  Bottom 0.152: v56.31,58.91 57.03,58.91 63.37,65.25 68.47,65.25 69.63,66.41 69.63,67.93 67.13,70.43 58.82,70.43 55.15,74.1 54.35,74.1 JP2.RXI